# EasyEDA Pro project ProDoc_Board1_2025-04-20.epro, schematic Schematic1

## Sheets
1 P1: Board Name: Board1; Create Date: 2025-03-16; Page Name: P1; Project Name: Unpuppeteer_MR25; Schematic Name: Schematic1; Update Date: 2025-03-31; Company: EasyEDA.com; Page Size: A4; Version: V1.0
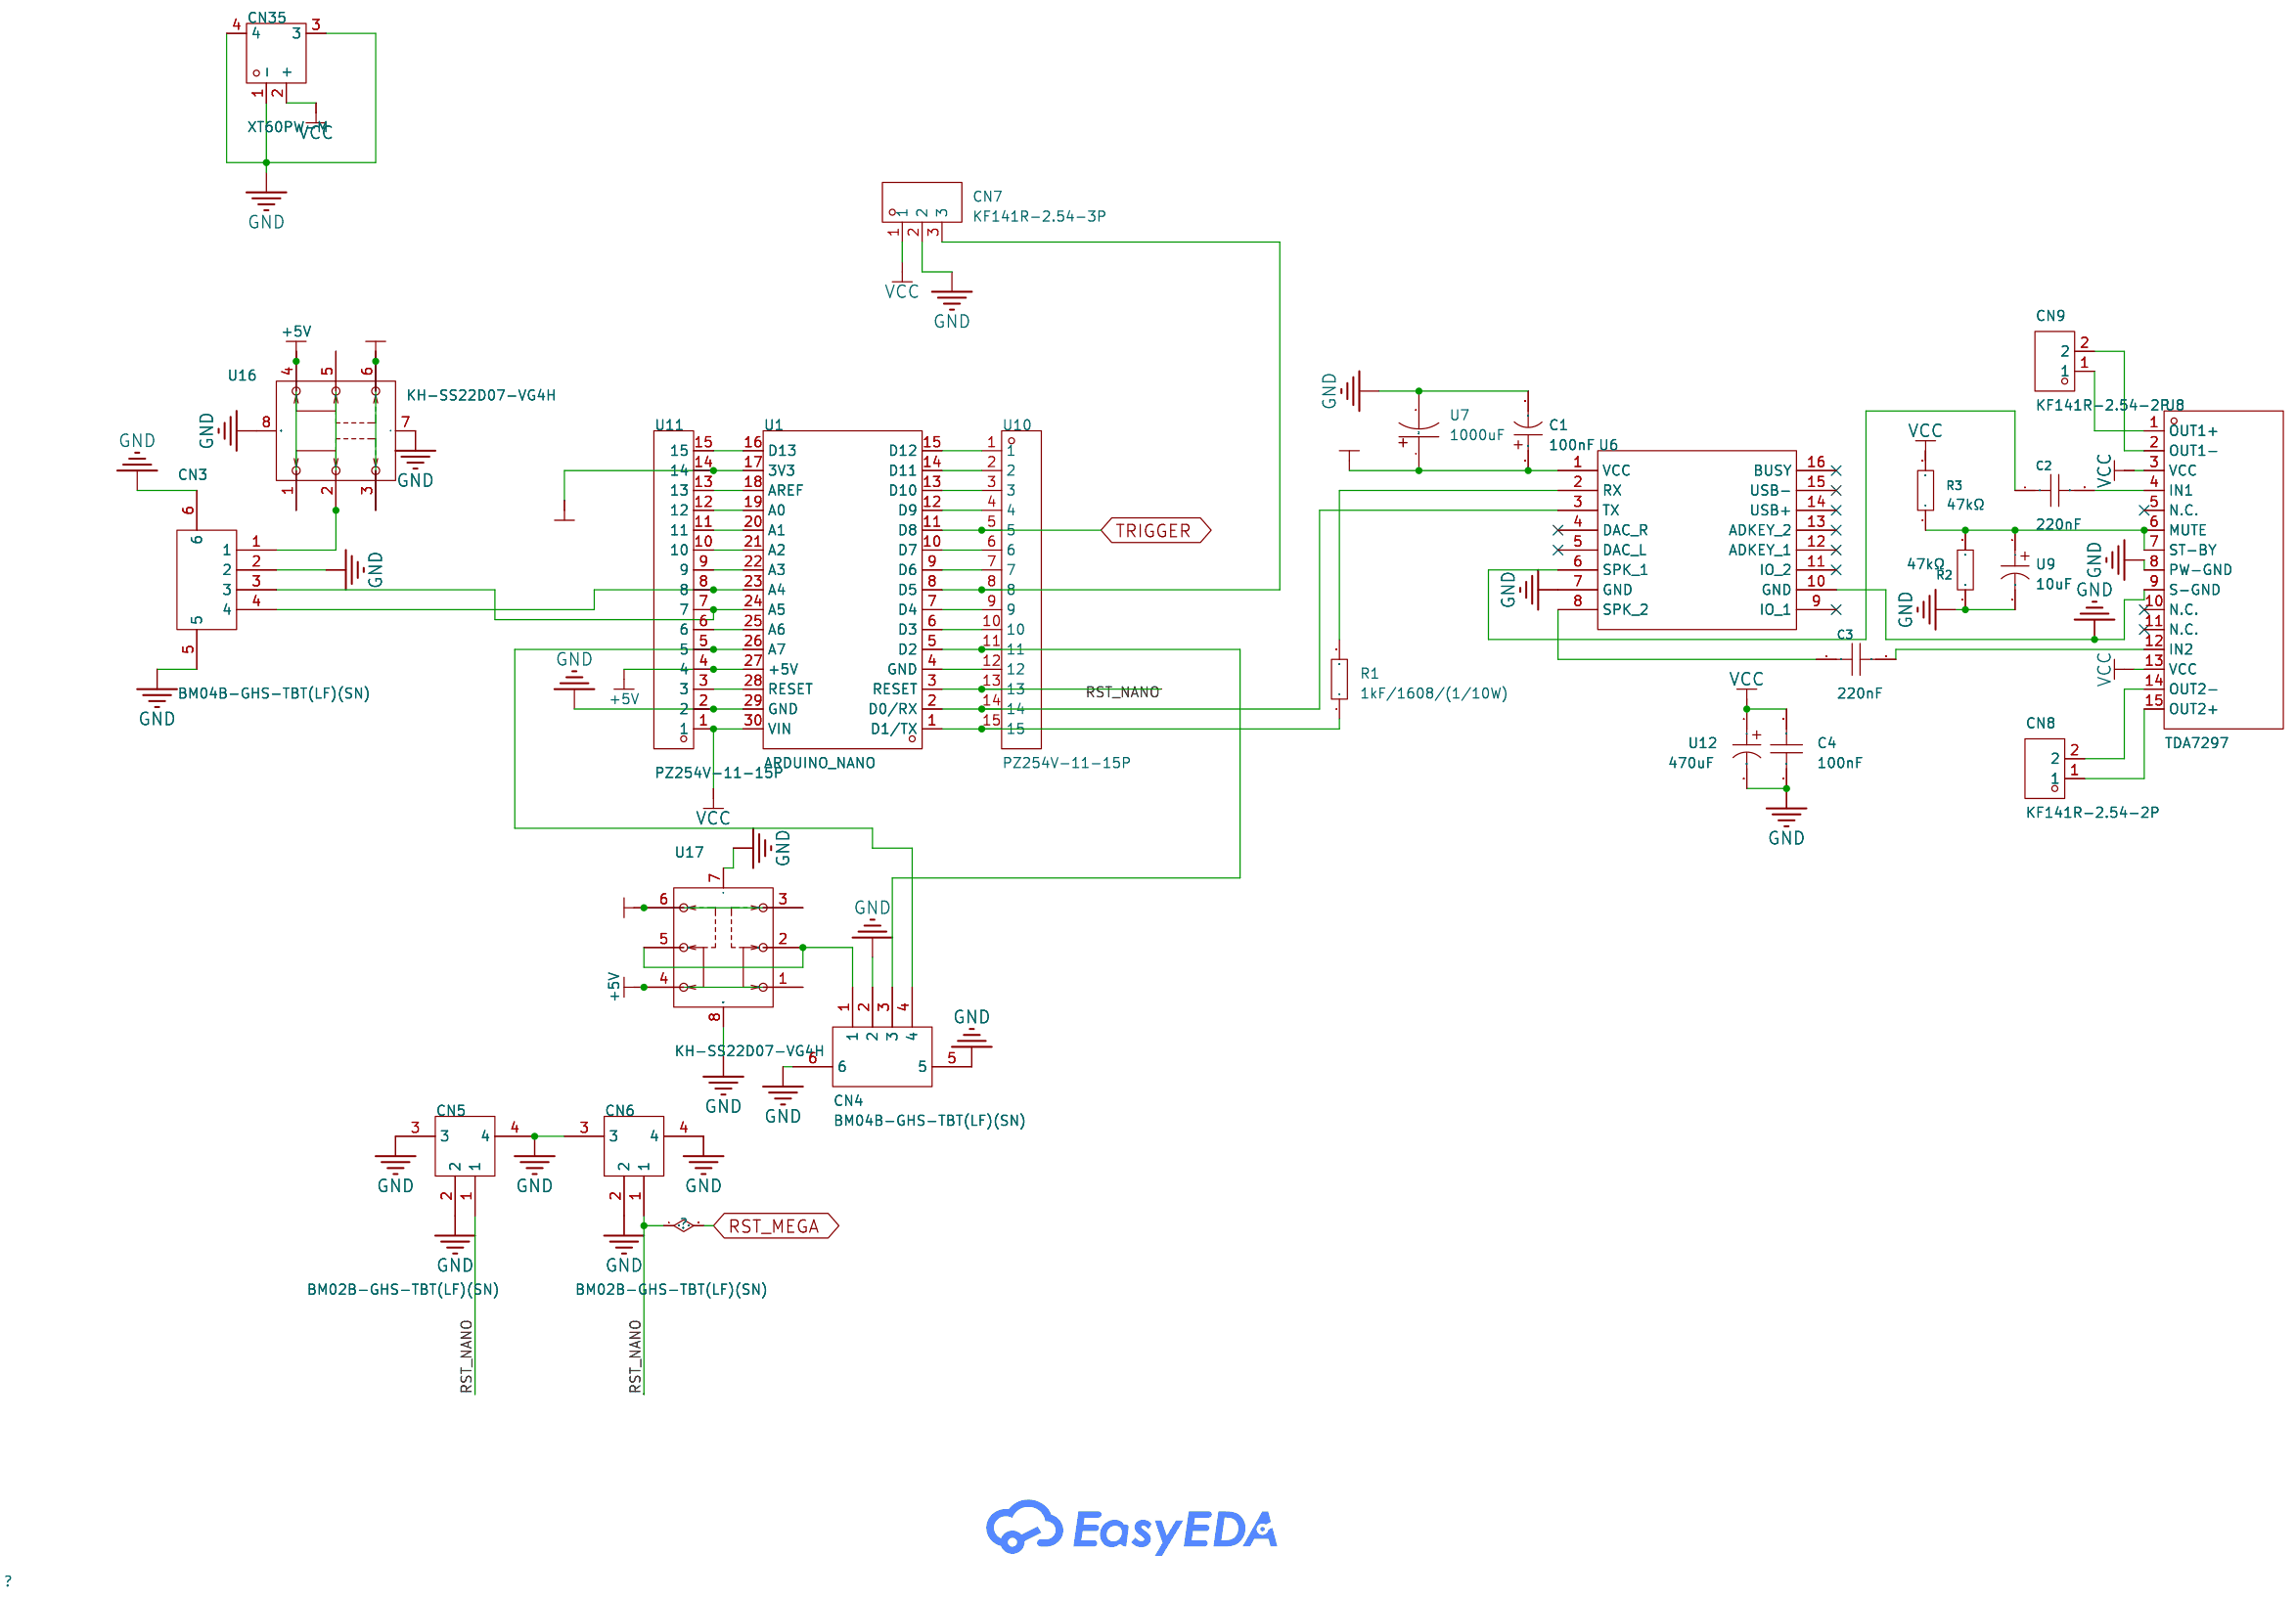
[diagram p0: P1]
2 P2: Create Date: 2025-03-30; Page Name: P2
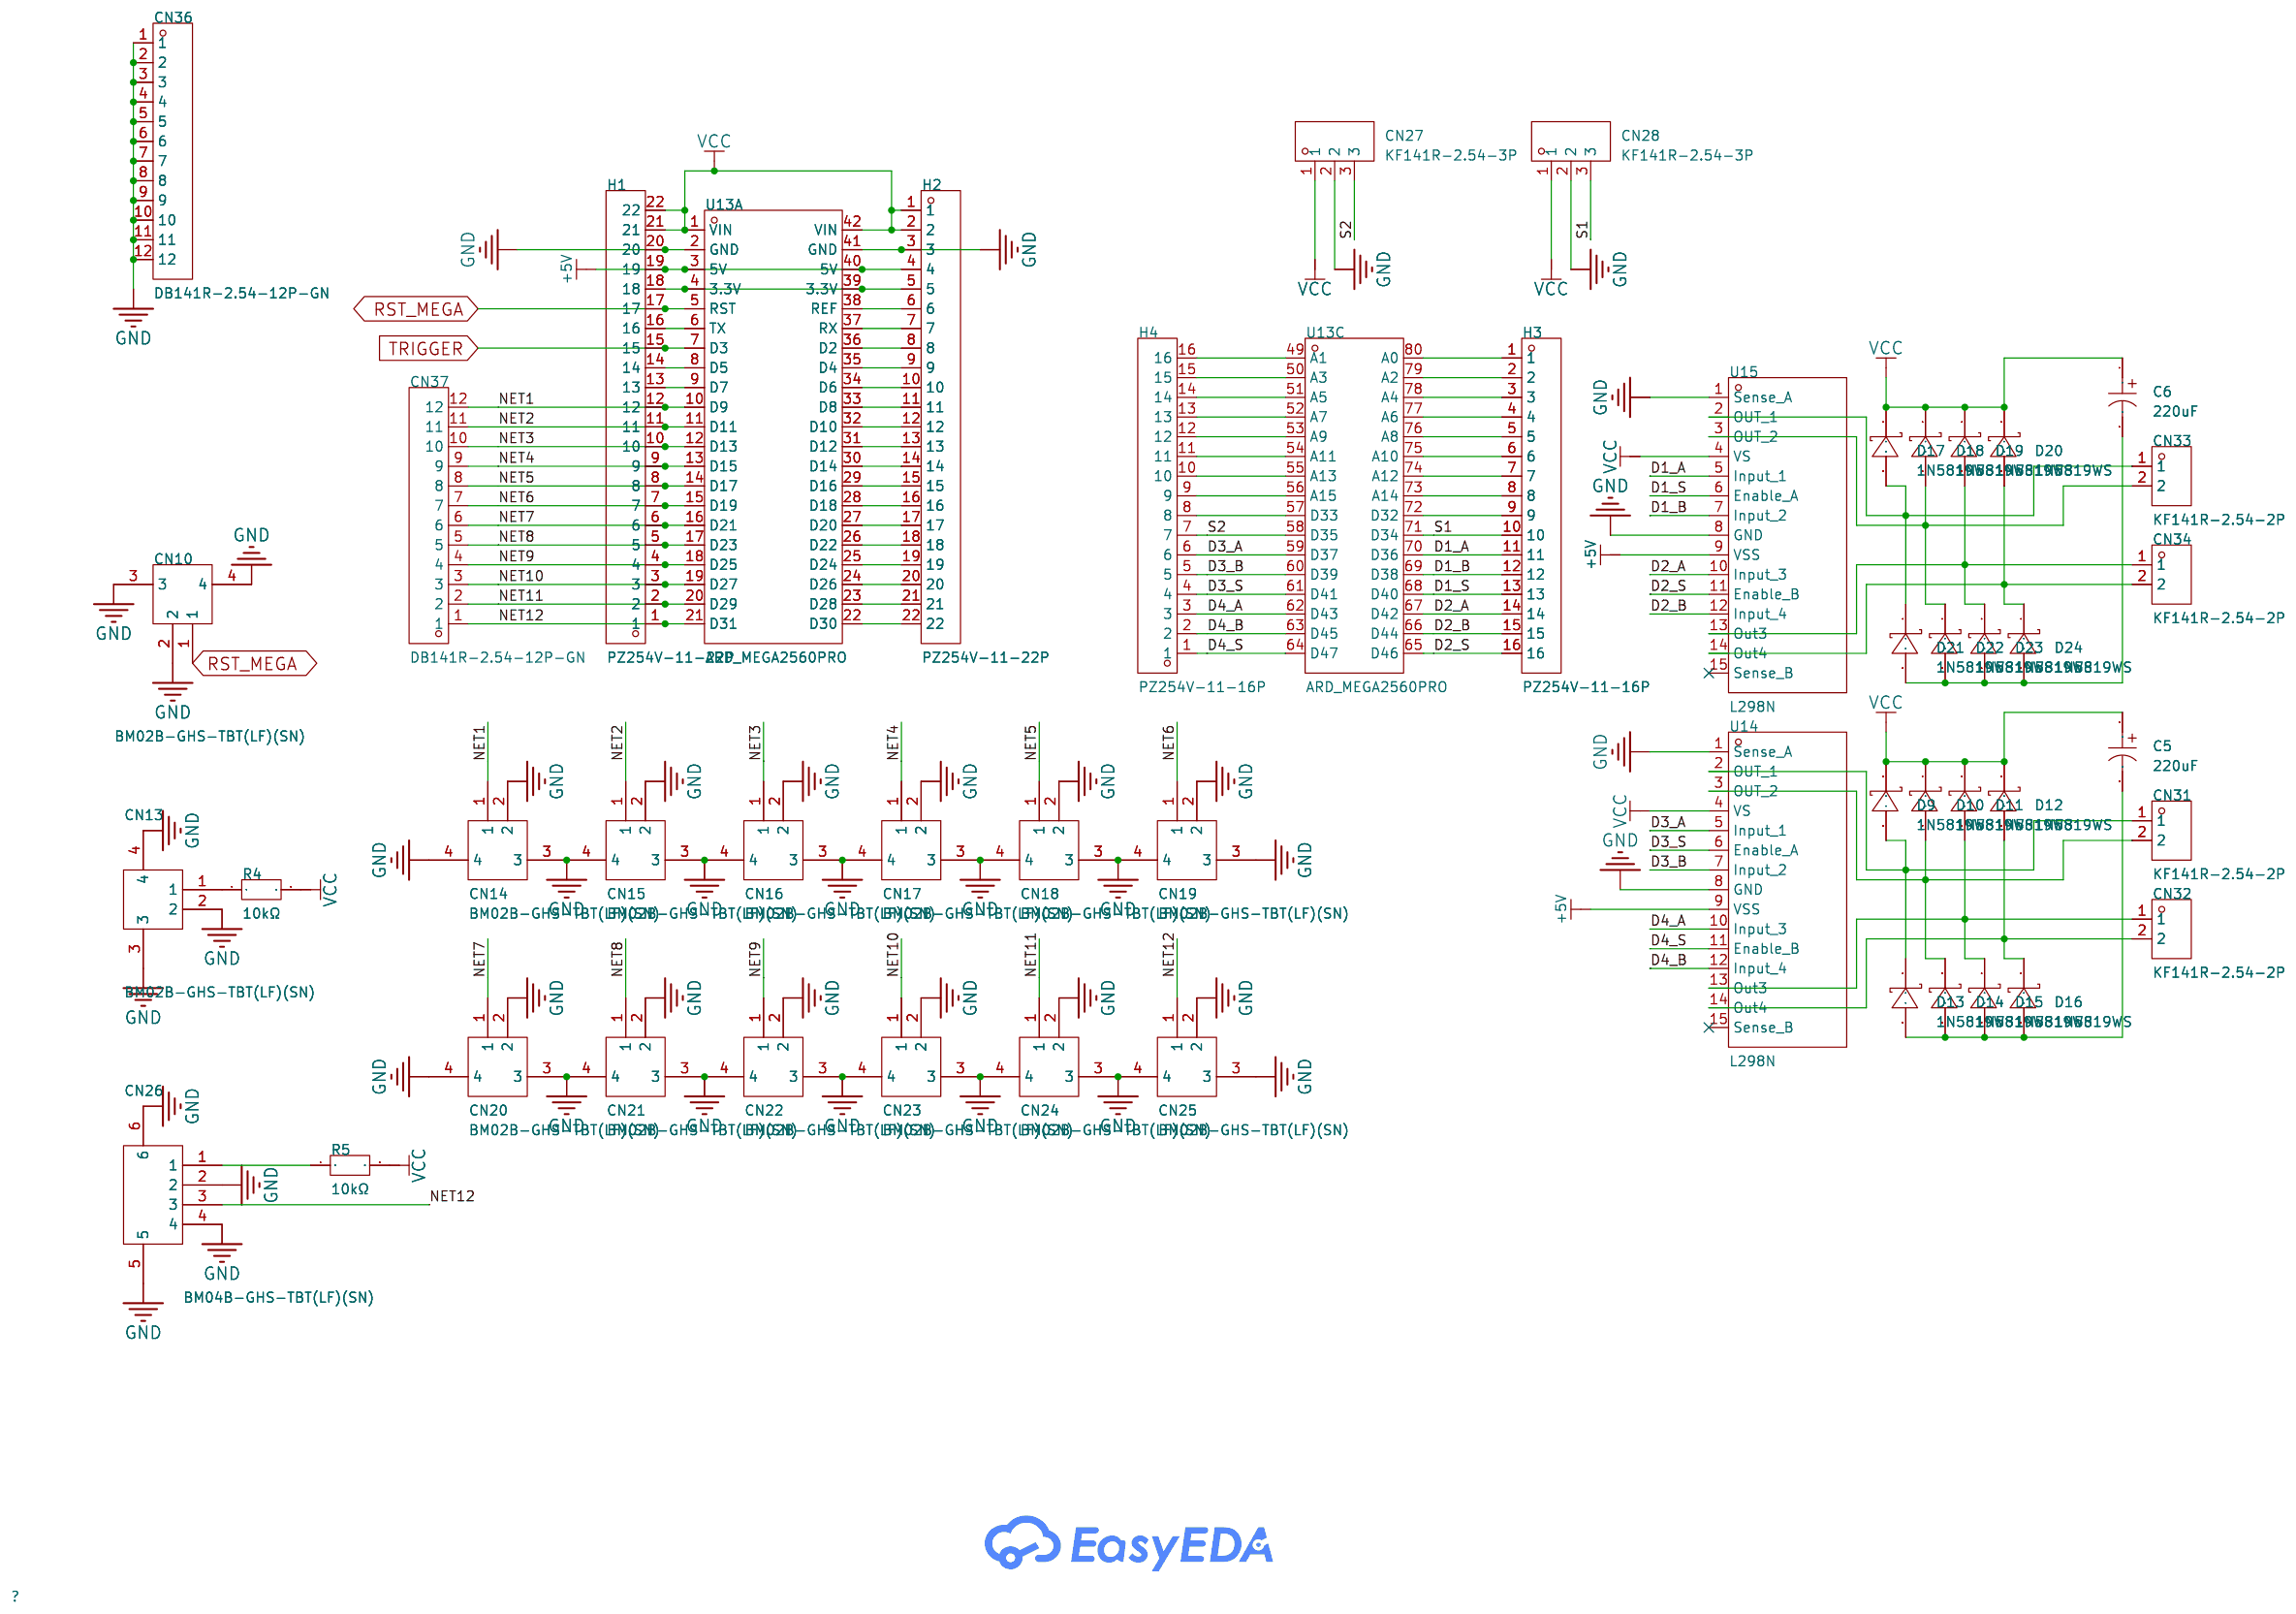
[diagram p1: P2]

## Parts
sheet P1
C1  100nF  [CAP-SMD_L3.2-W1.6-RD]
C2  220nF  [C0603]
C3  220nF  [C0603]
C4  100nF  [C0603]
CN3  BM04B-GHS-TBT(LF)(SN)  [CONN-SMD_4P-P1.25_BM04B-GHS-TBT-LF-SN]
CN4  BM04B-GHS-TBT(LF)(SN)  [CONN-SMD_4P-P1.25_BM04B-GHS-TBT-LF-SN]
CN5  BM02B-GHS-TBT(LF)(SN)  [CONN-SMD_2P-P1.25_BM02B-GHS-TBT-LF-SN]
CN6  BM02B-GHS-TBT(LF)(SN)  [CONN-SMD_2P-P1.25_BM02B-GHS-TBT-LF-SN]
CN7  KF141R-2.54-3P  [CONN-TH_3P-P2.54_KF141R-2.54-3P]
CN8  KF141R-2.54-2P  [CONN-TH_2P-P2.54_KF141R-2.54-2P]
CN9  KF141R-2.54-2P  [CONN-TH_2P-P2.54_KF141R-2.54-2P]
CN35  XT60PW-M  [CONN-TH_XT60PW-M]
R1  1kF/1608/(1/10W)  [R0603]
R2  47kΩ  [R0603]
R3  47kΩ  [R0603]
U1  ARDUINO_NANO  [COMM-TH_ARDUINO_NANO]
U6  -  [DFplayer]
U7  1000uF  [CAP-TH_BD12.5-P5.00-D0.6-FD]
U8  TDA7297  [MULTIWATT-15_L19.6-W5.0-P1.27-L]
U9  10uF  [CAP-SMD_BD4.0-L4.3-W4.3-LS5.0-FD]
U10  PZ254V-11-15P  [HDR-TH_15P-P2.54-V-M]
U11  PZ254V-11-15P  [HDR-TH_15P-P2.54-V-M]
U12  470uF  [CAP-SMD_BD6.3-L6.6-W6.6-LS7.2-FD]
U16  KH-SS22D07-VG4H  [SW-TH_KH-SS22D07-VG4H]
U17  KH-SS22D07-VG4H  [SW-TH_KH-SS22D07-VG4H]
sheet P2
C5  220uF  [CAP-TH_BD8.0-P3.50-D0.6-FD]
C6  220uF  [CAP-TH_BD8.0-P3.50-D0.6-FD]
CN10  BM02B-GHS-TBT(LF)(SN)  [CONN-SMD_2P-P1.25_BM02B-GHS-TBT-LF-SN]
CN13  BM02B-GHS-TBT(LF)(SN)  [CONN-SMD_2P-P1.25_BM02B-GHS-TBT-LF-SN]
CN14  BM02B-GHS-TBT(LF)(SN)  [CONN-SMD_2P-P1.25_BM02B-GHS-TBT-LF-SN]
CN15  BM02B-GHS-TBT(LF)(SN)  [CONN-SMD_2P-P1.25_BM02B-GHS-TBT-LF-SN]
CN16  BM02B-GHS-TBT(LF)(SN)  [CONN-SMD_2P-P1.25_BM02B-GHS-TBT-LF-SN]
CN17  BM02B-GHS-TBT(LF)(SN)  [CONN-SMD_2P-P1.25_BM02B-GHS-TBT-LF-SN]
CN18  BM02B-GHS-TBT(LF)(SN)  [CONN-SMD_2P-P1.25_BM02B-GHS-TBT-LF-SN]
CN19  BM02B-GHS-TBT(LF)(SN)  [CONN-SMD_2P-P1.25_BM02B-GHS-TBT-LF-SN]
CN20  BM02B-GHS-TBT(LF)(SN)  [CONN-SMD_2P-P1.25_BM02B-GHS-TBT-LF-SN]
CN21  BM02B-GHS-TBT(LF)(SN)  [CONN-SMD_2P-P1.25_BM02B-GHS-TBT-LF-SN]
CN22  BM02B-GHS-TBT(LF)(SN)  [CONN-SMD_2P-P1.25_BM02B-GHS-TBT-LF-SN]
CN23  BM02B-GHS-TBT(LF)(SN)  [CONN-SMD_2P-P1.25_BM02B-GHS-TBT-LF-SN]
CN24  BM02B-GHS-TBT(LF)(SN)  [CONN-SMD_2P-P1.25_BM02B-GHS-TBT-LF-SN]
CN25  BM02B-GHS-TBT(LF)(SN)  [CONN-SMD_2P-P1.25_BM02B-GHS-TBT-LF-SN]
CN26  BM04B-GHS-TBT(LF)(SN)  [CONN-SMD_4P-P1.25_BM04B-GHS-TBT-LF-SN]
CN27  KF141R-2.54-3P  [CONN-TH_3P-P2.54_KF141R-2.54-3P]
CN28  KF141R-2.54-3P  [CONN-TH_3P-P2.54_KF141R-2.54-3P]
CN31  KF141R-2.54-2P  [CONN-TH_2P-P2.54_KF141R-2.54-2P]
CN32  KF141R-2.54-2P  [CONN-TH_2P-P2.54_KF141R-2.54-2P]
CN33  KF141R-2.54-2P  [CONN-TH_2P-P2.54_KF141R-2.54-2P]
CN34  KF141R-2.54-2P  [CONN-TH_2P-P2.54_KF141R-2.54-2P]
CN36  DB141R-2.54-12P-GN  [CONN-TH_12P-P2.54_DIBO_DB141R-2.54-12P]
CN37  DB141R-2.54-12P-GN  [CONN-TH_12P-P2.54_DIBO_DB141R-2.54-12P]
D9  1N5819WS  [SOD-323_L1.8-W1.3-LS2.5-RD]
D10  1N5819WS  [SOD-323_L1.8-W1.3-LS2.5-RD]
D11  1N5819WS  [SOD-323_L1.8-W1.3-LS2.5-RD]
D12  1N5819WS  [SOD-323_L1.8-W1.3-LS2.5-RD]
D13  1N5819WS  [SOD-323_L1.8-W1.3-LS2.5-RD]
D14  1N5819WS  [SOD-323_L1.8-W1.3-LS2.5-RD]
D15  1N5819WS  [SOD-323_L1.8-W1.3-LS2.5-RD]
D16  1N5819WS  [SOD-323_L1.8-W1.3-LS2.5-RD]
D17  1N5819WS  [SOD-323_L1.8-W1.3-LS2.5-RD]
D18  1N5819WS  [SOD-323_L1.8-W1.3-LS2.5-RD]
D19  1N5819WS  [SOD-323_L1.8-W1.3-LS2.5-RD]
D20  1N5819WS  [SOD-323_L1.8-W1.3-LS2.5-RD]
D21  1N5819WS  [SOD-323_L1.8-W1.3-LS2.5-RD]
D22  1N5819WS  [SOD-323_L1.8-W1.3-LS2.5-RD]
D23  1N5819WS  [SOD-323_L1.8-W1.3-LS2.5-RD]
D24  1N5819WS  [SOD-323_L1.8-W1.3-LS2.5-RD]
H1  PZ254V-11-22P  [HDR-TH_22P-P2.54-V-M]
H2  PZ254V-11-22P  [HDR-TH_22P-P2.54-V-M]
H3  PZ254V-11-16P  [HDR-TH_PZ254V-11-16P]
H4  PZ254V-11-16P  [HDR-TH_PZ254V-11-16P]
R4  10kΩ  [R0603]
R5  10kΩ  [R0603]
U13  ARD_MEGA2560PRO  [COMM-SMD_L54.0-W38.0-P2.54_ARD_MEGA2560PRO]  (sections 1,3)
U14  L298N  [MULTIWATT-15_L19.6-W5.0-P1.27-L]
U15  L298N  [MULTIWATT-15_L19.6-W5.0-P1.27-L]

## Library data of the parts
C1 = CA45-A-35V-0.1UF-K: Capacitance:0.1uF Tolerance:±10% Tolerance:±10% Voltage Rating:35V Operating Temperature:-55℃~+125℃ Operating Temperature:-55℃~+125℃; LCSC Part Name: 100nF ±10% 35V; Supplier Part: C2976900; Manufacturer: CEC(振华新云); Supplier Footprint: SMD,1.6x3.2mm; JLCPCB Part Class: Extended Part; Datasheet: https://atta.szlcsc.com/upload/public/pdf/source/20220222/C2C5F368BEBB90E653B4407F98E5644A.pdf; Supplier: LCSC; Tolerance: ±10%; Voltage Rating: 35V; Operating Temperature: -55℃~+125℃
C2 C3 = CC0603JRX7R6BB224: Capacitance: Tolerance:±5% Tolerance:±5% Voltage Rated: Temperature Coefficient:; LCSC Part Name: 220nF ±5% 10V; Supplier Part: C519555; Manufacturer: YAGEO(国巨); Supplier Footprint: 0603; JLCPCB Part Class: Extended Part; Datasheet: https://atta.szlcsc.com/upload/public/pdf/source/20200423/C519555_2B7F54E9D3A36DB23922F5F990BFC7E4.pdf; Supplier: LCSC; Tolerance: ±5%
C4 = C0603X104K050T: Capacitance: Tolerance:±10% Tolerance:±10% Voltage Rated: Temperature Coefficient:; LCSC Part Name: 100nF ±10% 50V; Supplier Part: C187860; Manufacturer: IHHEC(禾伸堂); Supplier Footprint: 0603; JLCPCB Part Class: Extended Part; Datasheet: https://atta.szlcsc.com/upload/public/pdf/source/20180316/B1A881EE882D7AA2911761F448C7BFE2.pdf; Supplier: LCSC; Tolerance: ±10%
CN3 CN4 CN26 = BM04B-GHS-TBT(LF)(SN): Pins Structure:1x4P Pitch:1.25mm Mounting Style:Standing paste Reference Series:GH Number of Pins:4P Number of Rows:1 Number of PINs Per Row:4 Row Spacing:- Current Rating (Max):1A Contact Material:Phosphor Bronze Contact Plating:Tin Operating Temperature; LCSC Part Name: 1x4P 间距:1.25mm 立贴 系列:GH; Supplier Part: C161692; Manufacturer: JST; Supplier Footprint: SMD,P=1.25mm; JLCPCB Part Class: Extended Part; Datasheet: https://atta.szlcsc.com/upload/public/pdf/source/20181009/C265379_627E5111B25906DAAB327E382701D435.pdf; Supplier: LCSC; Pins Structure: 1x4P; Pitch: 1.25mm; Mounting Style: Standing paste; Reference Series: GH; Number of Pins: 4P; Number of Rows: 1; Number of PINs Per Row: 4; Current Rating (Max): 1A; Contact Material: Phosphor Bronze; Contact Plating: Tin; Operating Temperature Range: -25℃~+85℃; Rated Voltage (Max): 50V; Plastic Material: PA9T; Flame Retardant Rating: UL94V-0; Supplementary Features: Auxiliary soldering legs; Colour: White; Z-Height of the Board: 4.05mm; X-Length of Bottom Edge on Board (Spacing Line): 8.25mm; Y-Width of Bottom Edge on Board: 4.32mm
CN5 CN6 CN10 CN13-CN25 = BM02B-GHS-TBT(LF)(SN)_C161690: Pins Structure:1x2P Pitch:1.25mm Mounting Style:Standing paste Reference Series:GH Number of Pins:2P Number of Rows:1 Number of PINs Per Row:2 Row Spacing:- Current Rating (Max):1A Contact Material:Phosphor Bronze Contact Plating:Tin Operating Temperature; LCSC Part Name: 1x2P 间距:1.25mm 立贴 系列:GH; Supplier Part: C161690; Manufacturer: JST; Supplier Footprint: SMD,P=1.25mm; JLCPCB Part Class: Extended Part; Datasheet: https://atta.szlcsc.com/upload/public/pdf/source/20181009/C265379_627E5111B25906DAAB327E382701D435.pdf; Supplier: LCSC; Pins Structure: 1x2P; Pitch: 1.25mm; Mounting Style: Standing paste; Reference Series: GH; Number of Pins: 2P; Number of Rows: 1; Number of PINs Per Row: 2; Current Rating (Max): 1A; Contact Material: Phosphor Bronze; Contact Plating: Tin; Operating Temperature Range: -25℃~+85℃; Rated Voltage (Max): 50V; Plastic Material: PA9T; Flame Retardant Rating: UL94V-0; Supplementary Features: Auxiliary soldering legs; Colour: White; Z-Height of the Board: 4.05mm; X-Length of Bottom Edge on Board (Spacing Line): 5.75mm; Y-Width of Bottom Edge on Board: 4.32mm
CN7 CN27 CN28 = KF141R-2.54-3P: Pitch:2.54mm Mounting Style:- Number of Pins:3P Number of PINs Per Row:3 Current Rating (Max):2A Voltage Rating (Max):150V Wire Gauge - AWG:20~26 Wire Gauge - mm2:1; LCSC Part Name: 2.54mm 每排P数:3; Supplier Part: C475125; Manufacturer: KEFA(科发); Supplier Footprint: 弯插,P=2.54mm; Datasheet: https://atta.szlcsc.com/upload/public/pdf/source/20230317/004F2527FDE2EE6C5B3638E5307452EA.pdf; Supplier: LCSC; Pitch: 2.54mm; Number of Pins: 3P; Number of PINs Per Row: 3; Current Rating (Max): 2A; Voltage Rating (Max): 150V; Wire Gauge - AWG: 20~26; Wire Gauge - mm2: 1
CN8 CN9 CN31-CN34 = KF141R-2.54-2P: Pitch:2.54mm Mounting Style:- Number of Pins:2P Number of PINs Per Row:2 Current Rating (Max):2A Voltage Rating (Max):150V Wire Gauge - AWG:20~26 Wire Gauge - mm2:1; LCSC Part Name: 2.54mm 每排P数:2; Supplier Part: C475124; Manufacturer: KEFA(科发); Supplier Footprint: 弯插,P=2.54mm; Datasheet: https://atta.szlcsc.com/upload/public/pdf/source/20230317/004F2527FDE2EE6C5B3638E5307452EA.pdf; Supplier: LCSC; Pitch: 2.54mm; Number of Pins: 2P; Number of PINs Per Row: 2; Current Rating (Max): 2A; Voltage Rating (Max): 150V; Wire Gauge - AWG: 20~26; Wire Gauge - mm2: 1
CN35 = XT60PW-M: Brand:艾迈斯 Model:XT60PW-M Power:- Output:- Input:- Size:- Interface:- Type:- Colour:Yellow MaximumCurrent:- Type:卧式插头 RatedVoltage:- Type1:- NumberOfUSBHoles:- InterfaceType:公头 MetalMaterial:- InsulationMaterial:- RatedCurrent:- RecommendedWireGauge:- Flam; LCSC Part Name: AMASS(艾迈斯)航模插头xt60连接器150公母对接pw锂电池公头 板插卧式XT60PW-M; Supplier Part: C98732; Manufacturer: AMASS(艾迈斯); JLCPCB Part Class: Extended Part; Datasheet: https://atta.szlcsc.com/upload/public/pdf/source/20240118/44A3DCFF53BE25DC65378AFFB21277A4.pdf; Supplier: LCSC; Brand: 艾迈斯; Type: 卧式插头; Colour: Yellow; InterfaceType: 公头
R1 = Res_0603: Supplier Footprint: 0603
R2 R3 = 0603WAJ0473T5E: Type:Thick Film Resistors Resistance:47kΩ Tolerance:±5% Tolerance:±5% Power(Watts): Overload Voltage (Max): Temperature Coefficient:±100ppm/℃ Temperature Coefficient:±100ppm/℃ Operating Temperature Range:-55℃~+155℃ Operating Temperature Range:-55℃~+155℃; LCSC Part Name: 47kΩ ±5% 100mW 厚膜电阻; Supplier Part: C25600; Manufacturer: UNI-ROYAL(厚声); Supplier Footprint: 0603; JLCPCB Part Class: Extended Part; Datasheet: https://atta.szlcsc.com/upload/public/pdf/source/20200306/C422600_1E6D84923E4A46A82E41ADD87F860B5C.pdf; Supplier: LCSC; Type: Thick Film Resistors; Tolerance: ±5%; Temperature Coefficient: ±100ppm/℃; Operating Temperature Range: -55℃~+155℃
U1 = ARDUINO_NANO: Supplier Part: C9900017879; Supplier Footprint: 插件; JLCPCB Part Class: Extended Part; Supplier: LCSC
U6 = DFplayer
U7 = 35YXF1000MEFC12.5X25: Capacitance: Tolerance:±20% Tolerance:±20% Rated Voltage: Ripple Current:- Equivalent Series Resistance(ESR):- Lead Spacing:5mm φD: L: Lifetime @ Temp:- Operating Temperature:-40℃~+105℃ Operating Temperature:-40℃~+105℃; LCSC Part Name: 1000uF ±20% 35V; Supplier Part: C439893; Manufacturer: rubycon(红宝石); Supplier Footprint: 插件,D12.5xL25mm; JLCPCB Part Class: Extended Part; Datasheet: https://atta.szlcsc.com/upload/public/pdf/source/20220328/A5ADB66C04EDDB14C10F1D30FE958B67.pdf; Supplier: LCSC; Tolerance: ±20%; Lead Spacing: 5mm; Operating Temperature: -40℃~+105℃
U8 = TDA7297: Type of Power Amplifier:AB类功放 Speaker Channels:双声道 Output Power:15Wx2@8Ω Supply Voltage:6.5V~18V Supply Voltage:6.5V~18V Operating Temperature:0℃~+70℃ Operating Temperature:0℃~+70℃; LCSC Part Name: 15W立体声AB类音频功率放大器; Supplier Part: C96009; Manufacturer: ST(意法半导体); Supplier Footprint: Multiwatt-15; JLCPCB Part Class: Extended Part; Datasheet: https://atta.szlcsc.com/upload/public/pdf/source/20180629/C96009_4667A6921378A6A57221667672FC0988.pdf; Supplier: LCSC; Type of Power Amplifier: AB类功放; Speaker Channels: 双声道; Output Power: 15Wx2@8Ω; Supply Voltage: 6.5V~18V; Operating Temperature: 0℃~+70℃
U9 = VT10UF16V167RV0128: Capacitance: Tolerance:±20% Tolerance:±20% Rated Voltage: Ripple Current:18mA@120kHz Equivalent Series Resistance(ESR):- φD: L: Lifetime @ Temp:2000hrs@105℃ Operating Temperature:-55℃~+105℃ Operating Temperature:-55℃~+105℃; LCSC Part Name: 10uF ±20% 16V; Supplier Part: C5246581; Manufacturer: KNSCHA(科尼盛); Supplier Footprint: SMD,D4xL5.4mm; JLCPCB Part Class: Extended Part; Datasheet: https://atta.szlcsc.com/upload/public/pdf/source/20221103/9F9BF07BB249386F3919A1DEC4ACBDCD.pdf; Supplier: LCSC; Tolerance: ±20%; Ripple Current: 18mA@120kHz; Lifetime @ Temp: 2000hrs@105℃; Operating Temperature: -55℃~+105℃
U10 U11 = PZ254V-11-15P: LCSC Part Name: 排针2.54mm间距 单排 1x15P 直插 方针; Supplier Part: C22465875; Manufacturer: XFCN(兴飞); Supplier Footprint: 插件,P=2.54mm; JLCPCB Part Class: Extended Part; Datasheet: https://atta.szlcsc.com/upload/public/pdf/source/20240617/C325FF89D0FCE13B2A10BE2D3D7E6B84.pdf; Supplier: LCSC
U12 = RST470UF10V029: Capacitance:470uF Tolerance:±20% Tolerance:±20% Voltage Rating:10V Ripple Current:260mA@120Hz Equivalent Series Resistance(ESR):- Diameter:6.3mm Height - Seated (Max):7.7mm Lifetime:2000hrs@105℃ Operating Temperature:-40℃~+105℃ Operating Temperature:-40℃~; LCSC Part Name: 470uF ±20% 10V; Supplier Part: C4747954; Manufacturer: KNSCHA(科尼盛); Supplier Footprint: SMD,D6.3xL7.7mm; JLCPCB Part Class: Extended Part; Datasheet: https://atta.szlcsc.com/upload/public/pdf/source/20240124/A0DA8922E06D6A2EA9956F97D1533C5B.pdf; Supplier: LCSC; Tolerance: ±20%; Voltage Rating: 10V; Ripple Current: 260mA@120Hz; Diameter: 6.3mm; Height - Seated (Max): 7.7mm; Lifetime: 2000hrs@105℃; Operating Temperature: -40℃~+105℃
U16 U17 = KH-SS22D07-VG4H: LCSC Part Name: 拨动开关 KH-SS22D07-VG4H 弹片; Supplier Part: C5274482; Manufacturer: kinghelm(金航标); Supplier Footprint: 插件; JLCPCB Part Class: Extended Part; Datasheet: https://atta.szlcsc.com/upload/public/pdf/source/20221118/BDB168700385F9554FF7D5C313B2842A.pdf; Supplier: LCSC
C5 C6 = HG1H227M0816PC: Capacitance:220uF Tolerance:±20% Tolerance:±20% Rated Voltage: Ripple Current:2.75A Equivalent Series Resistance(ESR):38mΩ Lead Spacing: φD: L: Lifetime @ Temp:2000hrs@105℃ Operating Temperature:-55℃~+105℃ Operating Temperature:-55℃~+105℃; LCSC Part Name: 220uF ±20% 50V; Supplier Part: C5438873; Manufacturer: HONOR(荣誉); Supplier Footprint: 插件,D8xL16mm; JLCPCB Part Class: Extended Part; Datasheet: https://atta.szlcsc.com/upload/public/pdf/source/20230323/E6B46A248FBB182638B68380B3289E6D.pdf; Supplier: LCSC; Tolerance: ±20%; Ripple Current: 2.75A; Equivalent Series Resistance(ESR): 38mΩ; Lifetime @ Temp: 2000hrs@105℃; Operating Temperature: -55℃~+105℃
CN36 CN37 = DB141R-2.54-12P-GN: Structure:1x12P Pitch:2.54mm Color:Green Mounting Style:- Number of Pins:12P Number of PINs Per Row:12 Current Rating (Max):6A Voltage Rating (Max):130V Wire Gauge - AWG:20~24 Wire Gauge - mm2:0.2~1 Operating Temperature Range:-40℃~+105℃ Operating Tempera; LCSC Part Name: 1x12P 2.54mm 每排P数:12 排数:1; Supplier Part: C2898763; Manufacturer: DORABO(地博电气); Supplier Footprint: 弯插,P=2.54mm; JLCPCB Part Class: Extended Part; Datasheet: https://atta.szlcsc.com/upload/public/pdf/source/20230718/632B97B6BCC0B46287BF9EDF11A8C5D8.pdf; Supplier: LCSC; Structure: 1x12P; Pitch: 2.54mm; Color: Green; Number of Pins: 12P; Number of PINs Per Row: 12; Current Rating (Max): 6A; Voltage Rating (Max): 130V; Wire Gauge - AWG: 20~24; Wire Gauge - mm2: 0.2~1; Operating Temperature Range: -40℃~+105℃; Number of Rows: 1
D9-D24 = 1N5819WS_C191023: Forward Voltage (Vf@If):600mV@1A Reverse Voltage (Vr):40V Rectified Current:1A; LCSC Part Name: 电压:40V 电流:1A; Supplier Part: C191023; Manufacturer: Hottech(合科泰); Supplier Footprint: SOD-323; JLCPCB Part Class: Basic Part; Datasheet: https://atta.szlcsc.com/upload/public/pdf/source/20220428/3CB86FD8D28D653594B4E35F9D5AEFD9.pdf; Supplier: LCSC; Forward Voltage (Vf@If): 600mV@1A; Reverse Voltage (Vr): 40V; Rectified Current: 1A
H1 H2 = PZ254V-11-22P: Pin Structure:- Pitch:- Row Spacing:- Circluar Pins/Square Pins:- Mounting Type:- Number of Rows:- Number of Pins:- Current Rating (Max):- Voltage Rating (Max):- Length of Mating Pin:- Insulation Height:- Length of End Connection Pin:- Contact Material: C; Supplier Part: C22465881; Manufacturer: XFCN(兴飞); Supplier Footprint: 插件,P=2.54mm; JLCPCB Part Class: Extended Part; Datasheet: https://atta.szlcsc.com/upload/public/pdf/source/20240617/C325FF89D0FCE13B2A10BE2D3D7E6B84.pdf; Supplier: LCSC
H3 H4 = PZ254V-11-16P: LCSC Part Name: 排针2.54mm间距 单排 1x16P 直插 方针; Supplier Part: C22465876; Manufacturer: XFCN(兴飞); Supplier Footprint: 插件,P=2.54mm; JLCPCB Part Class: Extended Part; Datasheet: https://atta.szlcsc.com/upload/public/pdf/source/20240617/C325FF89D0FCE13B2A10BE2D3D7E6B84.pdf; Supplier: LCSC
R4 R5 = AT0603BRD0710KL: Type:Thin Film Resistor Resistance: Tolerance:±0.1% Tolerance:±0.1% Power(Watts): Overload Voltage (Max): Temperature Coefficient:±25ppm/℃ Temperature Coefficient:±25ppm/℃ Operating Temperature Range:-55℃~+155℃ Operating Temperature Range:-55℃~+155℃; LCSC Part Name: 薄膜电阻 10kΩ ±0.1% 100mW; Supplier Part: C723396; Manufacturer: YAGEO(国巨); Supplier Footprint: 0603; JLCPCB Part Class: Extended Part; Datasheet: https://atta.szlcsc.com/upload/public/pdf/source/20200722/C705051_EA338A836C78FCD1C867566BE6F43B3A.pdf; Supplier: LCSC; Type: Thin Film Resistor; Tolerance: ±0.1%; Temperature Coefficient: ±25ppm/℃; Operating Temperature Range: -55℃~+155℃
U13 = ARD_MEGA2560PRO: Supplier Part: C9900135944; Supplier Footprint: 插件; Supplier: LCSC
U14 U15 = L298N_C19922: Supplier Part: C19922; Manufacturer: ST(意法半导体); Supplier Footprint: MultiwAtt-15; JLCPCB Part Class: Extended Part; Datasheet: https://atta.szlcsc.com/upload/public/pdf/source/20131014/1457706655076.pdf; Supplier: LCSC

## Nets
+3.3V: C1.1 U1.17(3V3) U6.1(VCC) U7.1 U11.14 U16.3 U16.6 U17.3 U17.6
+5V: H1.19 H2.4 U1.27(+5V) U11.4 U13.3(5V) U13.40(5V) U14.9(VSS) U15.9(VSS) U16.1 U16.4 U17.1 U17.4
GND: C1.2 C4.1 CN3.2 CN3.5 CN3.6 CN4.2 CN4.5 CN4.6 CN5.2 CN5.3 CN5.4 CN6.2 CN6.3 CN6.4 CN7.2 CN10.2 CN10.3 CN10.4 CN13.2 CN13.3 CN13.4 CN14.2 CN14.3 CN14.4 CN15.2 CN15.3 CN15.4 CN16.2 CN16.3 CN16.4 CN17.2 CN17.3 CN17.4 CN18.2 CN18.3 CN18.4 CN19.2 CN19.3 CN19.4 CN20.2 CN20.3 CN20.4 CN21.2 CN21.3 CN21.4 CN22.2 CN22.3 CN22.4 CN23.2 CN23.3 CN23.4 CN24.2 CN24.3 CN24.4 CN25.2 CN25.3 CN25.4 CN26.2 CN26.4 CN26.5 CN26.6 CN27.2 CN28.2 CN35.1(-) CN35.3 CN35.4 CN36.1 CN36.2 CN36.3 CN36.4 CN36.5 CN36.6 CN36.7 CN36.8 CN36.9 CN36.10 CN36.11 CN36.12 H1.20 H2.3 R2.1 U1.29(GND) U6.7(GND) U6.10(GND) U7.2 U8.8(PW-GND) U8.9(S-GND) U9.2 U11.2 U12.2 U13.2(GND) U13.41(GND) U14.1(Sense A) U14.8(GND) U15.1(Sense A) U15.8(GND) U16.7 U16.8 U17.7 U17.8
VCC: C4.2 C5.1 C6.1 CN7.1 CN27.1 CN28.1 CN35.2(+) D9.1(K) D10.1(K) D11.1(K) D12.1(K) D17.1(K) D18.1(K) D19.1(K) D20.1(K) H1.21 H1.22 H2.1 H2.2 R3.2 R4.2 R5.2 U1.30(VIN) U8.3(VCC) U8.13(VCC) U11.1 U12.1 U13.1(VIN) U13.42(VIN) U14.4(VS) U15.4(VS)
D1_A: H3.11 U13.70(D36) U15.5(Input 1)
D1_B: H3.12 U13.69(D38) U15.7(Input 2)
D1_S: H3.13 U13.68(D40) U15.6(Enable A)
D2_A: H3.14 U13.67(D42) U15.10(Input 3)
D2_B: H3.15 U13.66(D44) U15.12(Input 4)
D2_S: H3.16 U13.65(D46) U15.11(Enable B)
D3_A: H4.6 U13.59(D37) U14.5(Input 1)
D3_B: H4.5 U13.60(D39) U14.7(Input 2)
D3_S: H4.4 U13.61(D41) U14.6(Enable A)
D4_A: H4.3 U13.62(D43) U14.10(Input 3)
D4_B: H4.2 U13.63(D45) U14.12(Input 4)
D4_S: H4.1 U13.64(D47) U14.11(Enable B)
NET1: CN14.1 CN37.12 H1.12 U13.10(D9)
NET2: CN15.1 CN37.11 H1.11 U13.11(D11)
NET3: CN16.1 CN37.10 H1.10 U13.12(D13)
NET4: CN17.1 CN37.9 H1.9 U13.13(D15)
NET5: CN18.1 CN37.8 H1.8 U13.14(D17)
NET6: CN19.1 CN37.7 H1.7 U13.15(D19)
NET7: CN20.1 CN37.6 H1.6 U13.16(D21)
NET8: CN21.1 CN37.5 H1.5 U13.17(D23)
NET9: CN22.1 CN37.4 H1.4 U13.18(D25)
NET10: CN23.1 CN37.3 H1.3 U13.19(D27)
NET11: CN24.1 CN37.2 H1.2 U13.20(D29)
NET12: CN25.1 CN26.3 CN37.1 H1.1 U13.21(D31)
RST_MEGA: CN5.1 CN6.1 CN10.1 H1.17 U1.3(RESET) U10.13 U13.5(RST)
S1: CN28.3 H3.10 U13.71(D34)
S2: CN27.3 H4.7 U13.58(D35)
TRIGGER: H1.15 U1.11(D8) U10.5 U13.7(D3)
$1N1361: U1.28(RESET) U11.3
$1N1386: CN4.4 U1.26(A7) U11.5
$1N1390: U1.25(A6) U11.6
$1N1395: CN3.3 U1.24(A5) U11.7
$1N1400: CN3.4 U1.23(A4) U11.8
$1N1405: U1.22(A3) U11.9
$1N1410: U1.21(A2) U11.10
$1N1415: U1.20(A1) U11.11
$1N1420: U1.19(A0) U11.12
$1N1425: U1.18(AREF) U11.13
$1N1435: U1.16(D13) U11.15
$1N1440: U1.15(D12) U10.1
$1N1445: U1.14(D11) U10.2
$1N1450: U1.13(D10) U10.3
$1N1455: U1.12(D9) U10.4
$1N1468: U1.10(D7) U10.6
$1N1472: U1.9(D6) U10.7
$1N1477: CN7.3 U1.8(D5) U10.8
$1N1482: U1.7(D4) U10.9
$1N1487: U1.6(D3) U10.10
$1N1492: CN4.3 U1.5(D2) U10.11
$1N1497: U1.4(GND) U10.12
$1N1507: U1.2(D0/RX) U6.3(TX) U10.14
$1N1512: R1.1 U1.1(D1/TX) U10.15
$1N1909: CN3.1 U16.2 U16.5
$1N2904: R1.2 U6.2(RX)
$1N3581: C2.1 U6.6(SPK_1)
$1N3694: C2.2 U8.4(IN1)
$1N3698: C3.2 U8.12(IN2)
$1N3703: C3.1 U6.8(SPK_2)
$1N3844: CN8.1 U8.15(OUT2+)
$1N3849: CN8.2 U8.14(OUT2-)
$1N3859: CN9.2 U8.2(OUT1-)
$1N3866: CN9.1 U8.1(OUT1+)
$1N3872: R2.2 R3.1 U8.6(MUTE) U8.7(ST-BY) U9.1
$1N7236: CN4.1 U17.2 U17.5
$2N2143: H1.18 H2.5 U13.4(3.3V) U13.39(3.3V)
$2N2148: H1.16 U13.6(TX)
$2N2156: H1.14 U13.8(D5)
$2N2160: H1.13 U13.9(D7)
$2N2235: H2.22 U13.22(D30)
$2N2239: H2.21 U13.23(D28)
$2N2244: H2.20 U13.24(D26)
$2N2249: H2.19 U13.25(D24)
$2N2254: H2.18 U13.26(D22)
$2N2259: H2.17 U13.27(D20)
$2N2264: H2.16 U13.28(D18)
$2N2296: H2.6 U13.38(REF)
$2N2301: H2.7 U13.37(RX)
$2N2306: H2.8 U13.36(D2)
$2N2311: H2.9 U13.35(D4)
$2N2316: H2.10 U13.34(D6)
$2N2321: H2.11 U13.33(D8)
$2N2326: H2.12 U13.32(D10)
$2N2337: H2.14 U13.30(D14)
$2N2341: H2.13 U13.31(D12)
$2N2346: H2.15 U13.29(D16)
$2N2352: H4.16 U13.49(A1)
$2N2354: H4.15 U13.50(A3)
$2N2356: H4.14 U13.51(A5)
$2N2358: H4.13 U13.52(A7)
$2N2360: H4.12 U13.53(A9)
$2N2362: H4.11 U13.54(A11)
$2N2364: H4.10 U13.55(A13)
$2N2366: H4.9 U13.56(A15)
$2N2368: H4.8 U13.57(D33)
$2N2398: H3.9 U13.72(D32)
$2N2400: H3.8 U13.73(A14)
$2N2402: H3.7 U13.74(A12)
$2N2404: H3.6 U13.75(A10)
$2N2406: H3.5 U13.76(A8)
$2N2408: H3.4 U13.77(A6)
$2N2410: H3.3 U13.78(A4)
$2N2412: H3.2 U13.79(A2)
$2N2414: H3.1 U13.80(A0)
$2N2537: CN13.1 R4.1
$2N3833: CN26.1 R5.1
$2N5612: CN31.1 D9.2(A) D13.1(K) U14.2(OUT 1)
$2N5623: CN31.2 D10.2(A) D14.1(K) U14.3(OUT 2)
$2N5632: CN32.1 D11.2(A) D15.1(K) U14.13(Out3)
$2N5638: CN32.2 D12.2(A) D16.1(K) U14.14(Out4)
$2N5825: C5.2 D13.2(A) D14.2(A) D15.2(A) D16.2(A)
$2N6593: C6.2 D21.2(A) D22.2(A) D23.2(A) D24.2(A)
$2N6599: CN33.2 D18.2(A) D22.1(K) U15.3(OUT 2)
$2N6609: CN34.2 D20.2(A) D24.1(K) U15.14(Out4)
$2N6617: CN33.1 D17.2(A) D21.1(K) U15.2(OUT 1)
$2N6627: CN34.1 D19.2(A) D23.1(K) U15.13(Out3)

Not connected (* = marked no-connect by the designer): U6 4(DAC_R)* 5(DAC_L)* 9(IO_1)* 11(IO_2)* 12(ADKEY_1)* 13(ADKEY_2)* 14(USB+)* 15(USB-)* 16(BUSY)*; U8 5(N.C.)* 10(N.C.)* 11(N.C.)*; U14 15(Sense B)*; U15 15(Sense B)*
